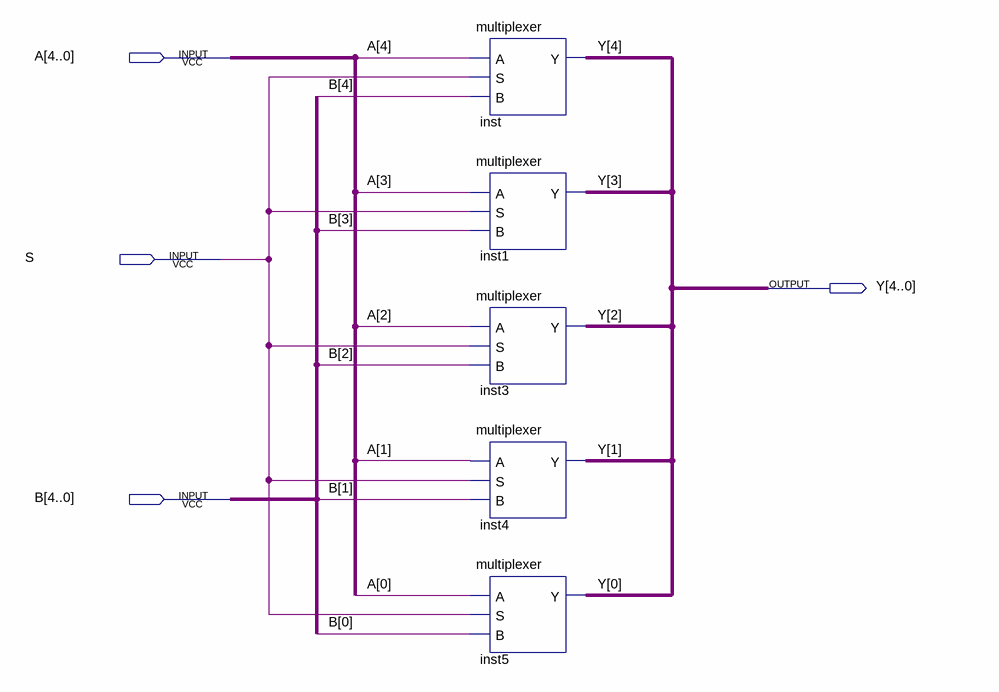
[diagram p0: schematic sheet]
// Quartus schematic mux5.bdf as structural Verilog: 5 symbols, 4 pins
module mux5 (
  input  [4:0] A,
  input  S,
  input  [4:0] B,
  output [4:0] Y
);

  multiplexer inst (.A(A[4]), .S(S), .B(B[4]), .Y(Y[4]));
  multiplexer inst1 (.A(A[3]), .S(S), .B(B[3]), .Y(Y[3]));
  multiplexer inst3 (.A(A[2]), .S(S), .B(B[2]), .Y(Y[2]));
  multiplexer inst4 (.A(A[1]), .S(S), .B(B[1]), .Y(Y[1]));
  multiplexer inst5 (.A(A[0]), .S(S), .B(B[0]), .Y(Y[0]));
endmodule
